# EAGLE schematic yaesulink (EAGLE 6.5.0)
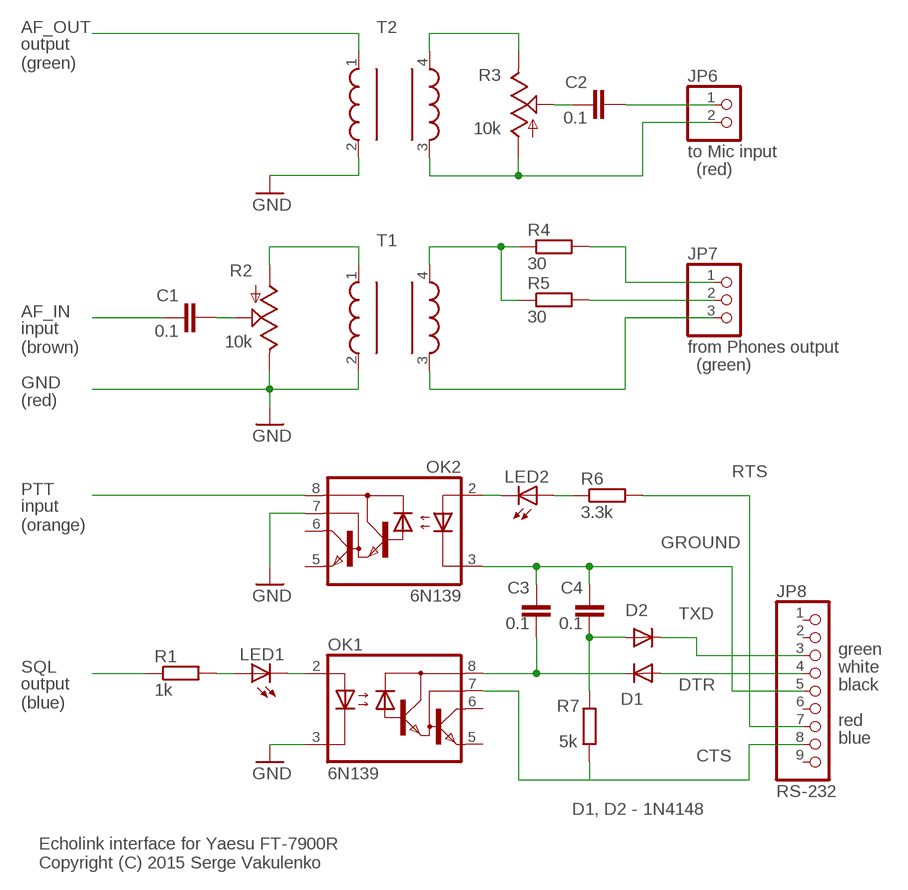
[diagram p0: schematic, sheet 1]

## Parts
C1  0.1  C-EU025-024X044  [C025-024X044]
C2  0.1  C-EU025-024X044  [C025-024X044]
C3  0.1  C-EU025-024X044  [C025-024X044]
C4  0.1  C-EU025-024X044  [C025-024X044]
D1  1N4148DO35-7  [DO35-7]
D2  1N4148DO35-7  [DO35-7]
JP6  to Mic input  PINHD-1X2  [1X02]
JP7  from Phones output  PINHD-1X3  [1X03]
JP8  RS-232  PINHD-1X9  [1X09]
LED1  LED3MM  [LED3MM]
LED2  LED3MM  [LED3MM]
OK1  6N139  6N138  [DIL08]
OK2  6N139  6N138  [DIL08]
R1  1k  R-EU_0207/10  [0207/10]
R2  10k  TRIM_US-B25P  [B25P]
R3  10k  TRIM_US-B25P  [B25P]
R4  30  R-EU_0207/10  [0207/10]
R5  30  R-EU_0207/10  [0207/10]
R6  3.3k  R-EU_0207/10  [0207/10]
R7  5k  R-EU_0207/10  [0207/10]
T1  TRANSFORMERPTH  [TRANSFORMER]
T2  TRANSFORMERPTH  [TRANSFORMER]

## Nets
AF_IN: C1.1
AF_OUT: T2.1
CTS: JP8.8 OK1.7(VB) R7.1
DTR: D1.A JP8.4
GND: OK1.3(C) OK2.7(VB) R2.E T1.2 T2.2
GROUND: C3.1 C4.1 JP8.5 OK2.3(C)
N$1: LED2.A R6.1
N$2: LED1.A R1.2
N$3: LED1.K(C) OK1.2(A)
N$5: C3.2 D1.C OK1.8(VCC)
N$6: LED2.K(C) OK2.2(A)
N$8: R2.A T1.1
N$9: C4.2 D2.A R7.2
N$10: C1.2 R2.S
N$13: R3.E T2.4
N$14: JP6.2 R3.A T2.3
N$15: C2.1 R3.S
N$16: C2.2 JP6.1
N$17: R4.1 R5.1 T1.4
N$18: JP7.2 R5.2
N$19: JP7.1 R4.2
N$20: JP7.3 T1.3
PTT: OK2.8(VCC)
RTS: JP8.7 R6.2
SQL: R1.1
TXD: D2.C JP8.3
Unconnected: JP8.1 JP8.2 JP8.6 JP8.9 OK1.5(GND) OK1.6(VO) OK2.5(GND) OK2.6(VO)

## Notes on the sheet
- output
  (green)
- (red)
- input
  (brown)
- (green)
- (red)
- input
  (orange)
- green
- white
- black
- output
  (blue)
- red
- blue
- D1, D2 - 1N4148
- Echolink interface for Yaesu FT-7900R
  Copyright (C) 2015 Serge Vakulenko

## Library data of the parts
C1-C4 = resistor:C-EU: CAPACITOR, European symbol
D1 D2 = diode:1N4148: DIODE high speed (Philips)
JP6 = pinhead:PINHD-1X2: PIN HEADER
JP7 = pinhead:PINHD-1X3: PIN HEADER
JP8 = pinhead:PINHD-1X9: PIN HEADER
LED1 LED2 = led:LED: LED OSRAM: - CHIPLED LG R971, LG N971, LY N971, LG Q971, LY Q971, LO R971, LY R971 LH N974, LH R974 LS Q976, LO Q976, LY Q976 LO Q996 - Hyper CHIPLED LW Q18S LB Q993, LB Q99A, LB R99A - SideLED LS A670, LO A670, LY A670, LG A670, LP A670 LB A673, LV A673, LT A673, LW A673 LH A674 LY A675 LS A676, LA A676, LO A676, LY A676, LW A676 LS A679, LY A679, LG A679 - Hyper Micro SIDELED® LS Y876, LA Y876, LO Y876, LY Y876 LT Y87S - SmartLED LW L88C, LW L88S LB L89C, LB L89S, LG L890 LS L89K, LO L89K, LY L89K LS L896, LA L896, LO L896, LY L896 - TOPLED LS T670, LO T670, LY T670, LG T670, LP T670 LSG T670, LSP T670, LSY T670, LOP T670, LYG T670 LG T671, LOG T671, LSG T671 LB T673, LV T673, LT T673, LW T673 LH T674 LS T676, LA T676, LO T676, LY T676, LB T676, LH T676, LSB T676, LW T676 LB T67C, LV T67C, LT T67C, LS T67K, LO T67K, LY T67K, LW E67C LS E67B, LA E67B, LO E67B, LY E67B, LB E67C, LV E67C, LT E67C LW T67C LS T679, LY T679, LG T679 LS T770, LO T770, LY T770, LG T770, LP T770 LB T773, LV T773, LT T773, LW T773 LH T774 LS E675, LA E675, LY E675, LS T675 LS T776, LA T776, LO T776, LY T776, LB T776 LHGB T686 LT T68C, LB T68C - Hyper Mini TOPLED® LB M676 - Mini TOPLED Santana® LG M470 LS M47K, LO M47K, LY M47K Source: http://www.osram.convergy.de LUXEON: - LUMILED® LXK2-PW12-R00, LXK2-PW12-S00, LXK2-PW14-U00, LXK2-PW14-V00 LXK2-PM12-R00, LXK2-PM12-S00, LXK2-PM14-U00 LXK2-PE12-Q00, LXK2-PE12-R00, LXK2-PE12-S00, LXK2-PE14-T00, LXK2-PE14-U00 LXK2-PB12-K00, LXK2-PB12-L00, LXK2-PB12-M00, LXK2-PB14-N00, LXK2-PB14-P00, LXK2-PB14-Q00 LXK2-PR12-L00, LXK2-PR12-M00, LXK2-PR14-Q00, LXK2-PR14-R00 LXK2-PD12-Q00, LXK2-PD12-R00, LXK2-PD12-S00 LXK2-PH12-R00, LXK2-PH12-S00 LXK2-PL12-P00, LXK2-PL12-Q00, LXK2-PL12-R00 Source: www.luxeon.com KINGBRIGHT: KA-3528ASYC Source: www.kingbright.com
OK1 OK2 = optocoupler:6N138: MOTOROLA OPTO COUPLER; MF: VISHAY/TELEFUNKEN; MPN: 6N139; OC_FARNELL: 9860150; OC_NEWARK: 35K5294
R1 R4-R7 = resistor:R-EU_: RESISTOR, European symbol
R2 R3 = pot:TRIM_US-: POTENTIOMETER
T1 T2 = SparkFun:TRANSFORMER